# Altium schematic sheet ledDrive.SchDoc
size A4
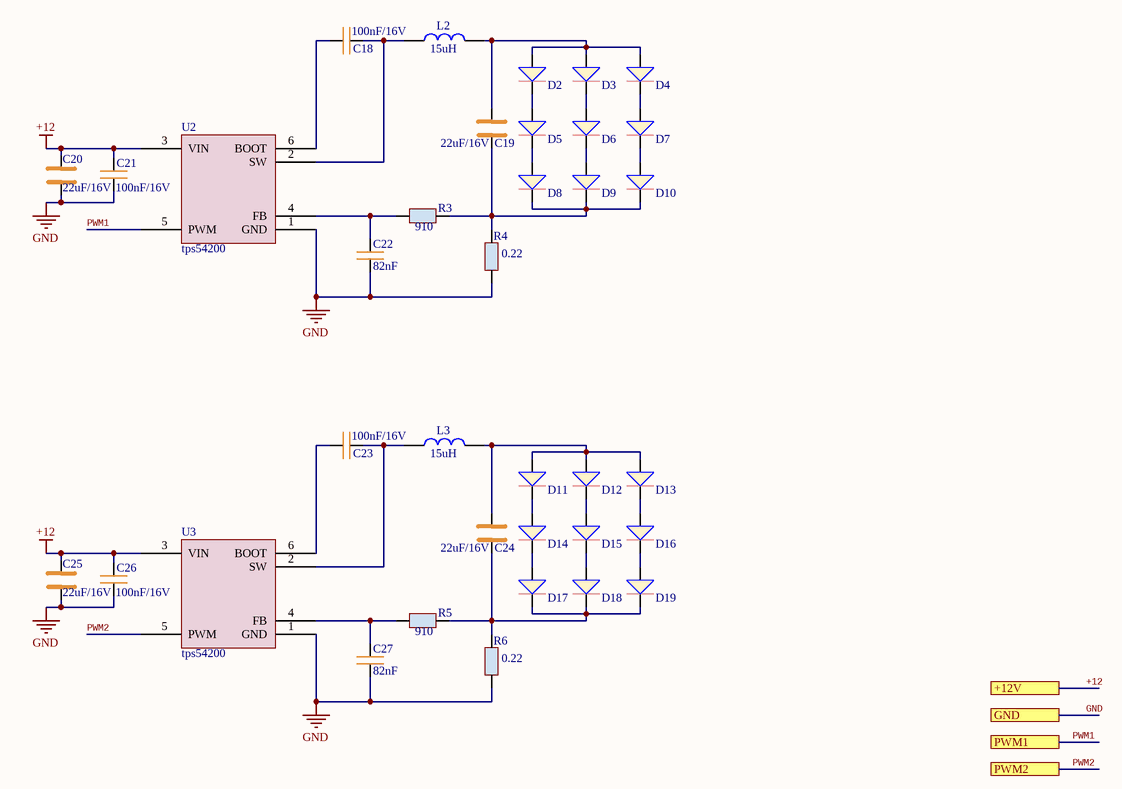
[diagram p0: ledDrive.SchDoc]

## Parts
C18  100nF/16V  [CAP0603]
C19  22uF/16V  [cap1210]
C20  22uF/16V  [cap1210]
C21  100nF/16V  [CAP0603]
C22  82nF  [CAP0603]
C23  100nF/16V  [CAP0603]
C24  22uF/16V  [cap1210]
C25  22uF/16V  [cap1210]
C26  100nF/16V  [CAP0603]
C27  82nF  [CAP0603]
D2  LED3030  [LED3030]  (value not drawn)
D3  LED3030  [LED3030]  (value not drawn)
D4  LED3030  [LED3030]  (value not drawn)
D5  LED3030  [LED3030]  (value not drawn)
D6  LED3030  [LED3030]  (value not drawn)
D7  LED3030  [LED3030]  (value not drawn)
D8  LED3030  [LED3030]  (value not drawn)
D9  LED3030  [LED3030]  (value not drawn)
D10  LED3030  [LED3030]  (value not drawn)
D11  LED3030  [LED3030]  (value not drawn)
D12  LED3030  [LED3030]  (value not drawn)
D13  LED3030  [LED3030]  (value not drawn)
D14  LED3030  [LED3030]  (value not drawn)
D15  LED3030  [LED3030]  (value not drawn)
D16  LED3030  [LED3030]  (value not drawn)
D17  LED3030  [LED3030]  (value not drawn)
D18  LED3030  [LED3030]  (value not drawn)
D19  LED3030  [LED3030]  (value not drawn)
L2  15uH  [Inductor7x7]
L3  15uH  [Inductor7x7]
R3  910  [res0603]
R4  0.22  [res1206]
R5  910  [res0603]
R6  0.22  [res1206]
U2  tps54200  [TPS54200]
U3  tps54200  [TPS54200]

## Ports
+12V, GND, PWM1, PWM2

## Nets
+12: C20.2 C21.2 C25.2 C26.2 U2.3(VIN) U3.3(VIN) ; port +12V
GND: C20.1 C21.1 C22.2 C25.1 C26.1 C27.2 R4.1 R6.1 U2.1(GND) U3.1(GND) ; port GND
PWM1: U2.5(PWM) ; port PWM1
PWM2: U3.5(PWM) ; port PWM2
NetC18_1: C18.1 L2.1 U2.2(SW)
NetC18_2: C18.2 U2.6(BOOT)
NetC19_1: C19.1 D8.1 D9.1 D10.1 R3.2 R4.2
NetC19_2: C19.2 D2.2 D3.2 D4.2 L2.2
NetC22_1: C22.1 R3.1 U2.4(FB)
NetC23_1: C23.1 L3.1 U3.2(SW)
NetC23_2: C23.2 U3.6(BOOT)
NetC24_1: C24.1 D17.1 D18.1 D19.1 R5.2 R6.2
NetC24_2: C24.2 D11.2 D12.2 D13.2 L3.2
NetC27_1: C27.1 R5.1 U3.4(FB)
NetD2_1: D2.1 D5.2
NetD3_1: D3.1 D6.2
NetD4_1: D4.1 D7.2
NetD5_1: D5.1 D8.2
NetD6_1: D6.1 D9.2
NetD7_1: D7.1 D10.2
NetD11_1: D11.1 D14.2
NetD12_1: D12.1 D15.2
NetD13_1: D13.1 D16.2
NetD14_1: D14.1 D17.2
NetD15_1: D15.1 D18.2
NetD16_1: D16.1 D19.2

## Library data of the parts
C18 C21-C23 C26 C27 = CAP0603
C19 C20 C24 C25 = CAP1210
L2 L3 = ind7x7: a ind
R3 R5 = RES0603
R4 R6 = RES1206